# EAGLE schematic Daughter Card v5 (EAGLE 7.7.0)
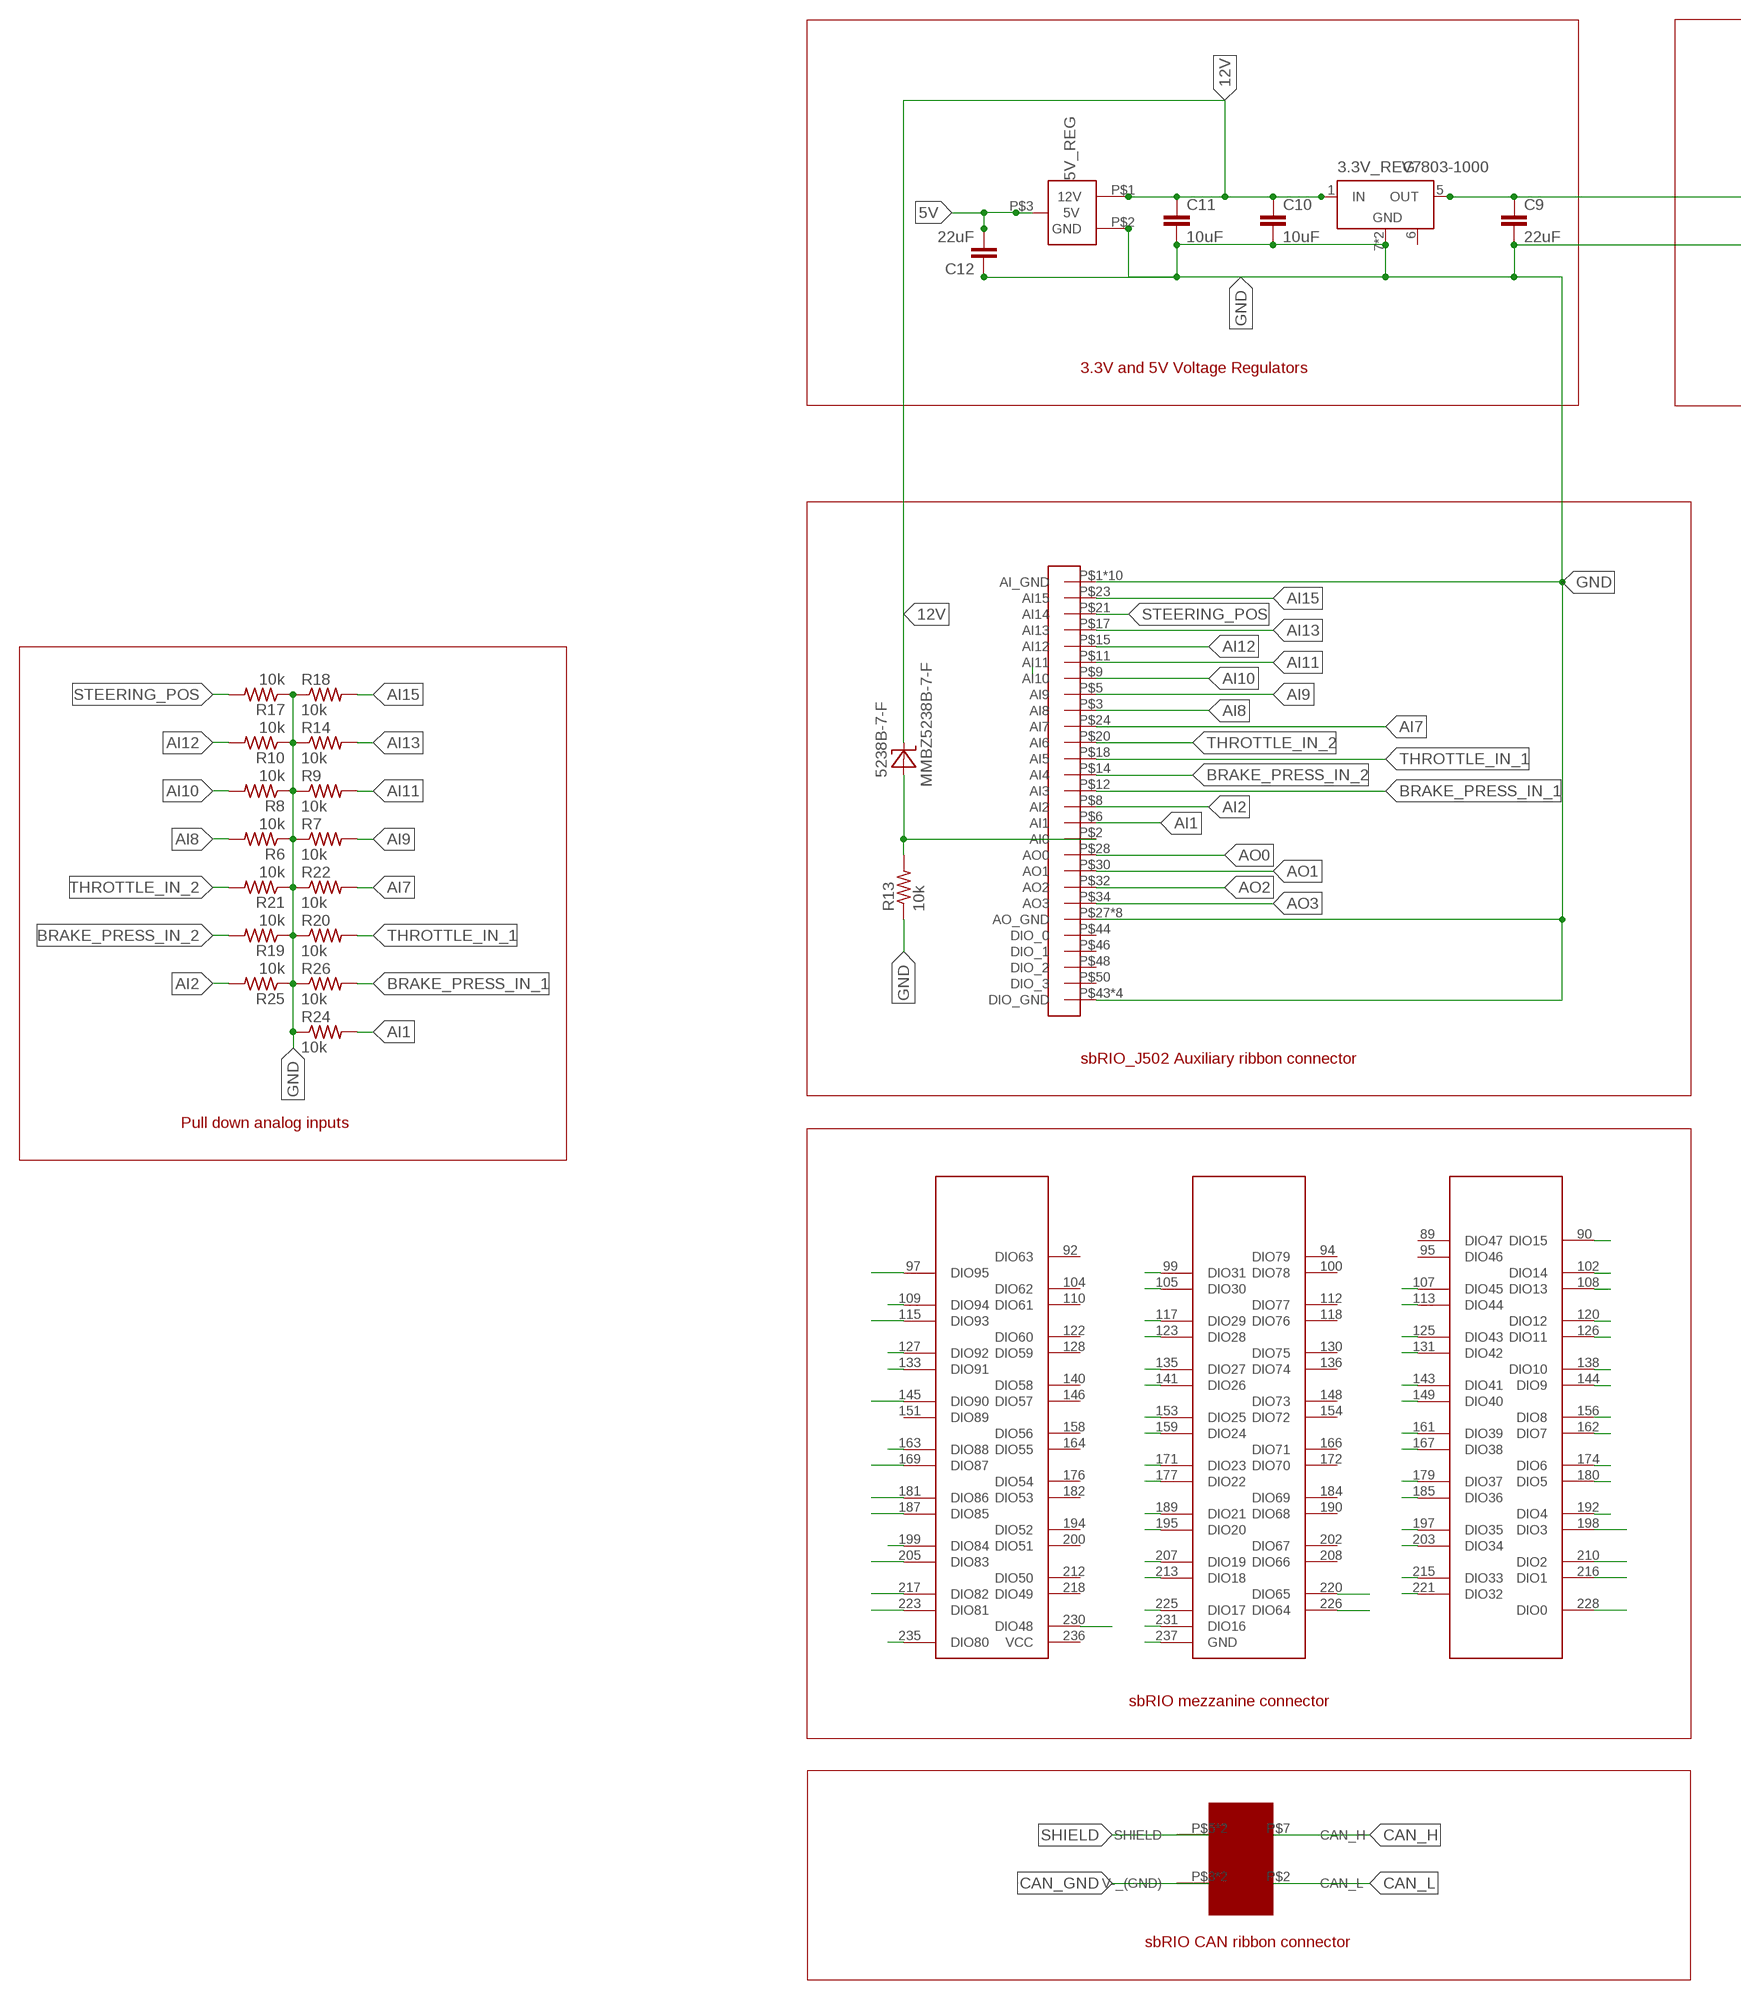
[diagram p0: schematic, sheet 1, part 1 of 2]
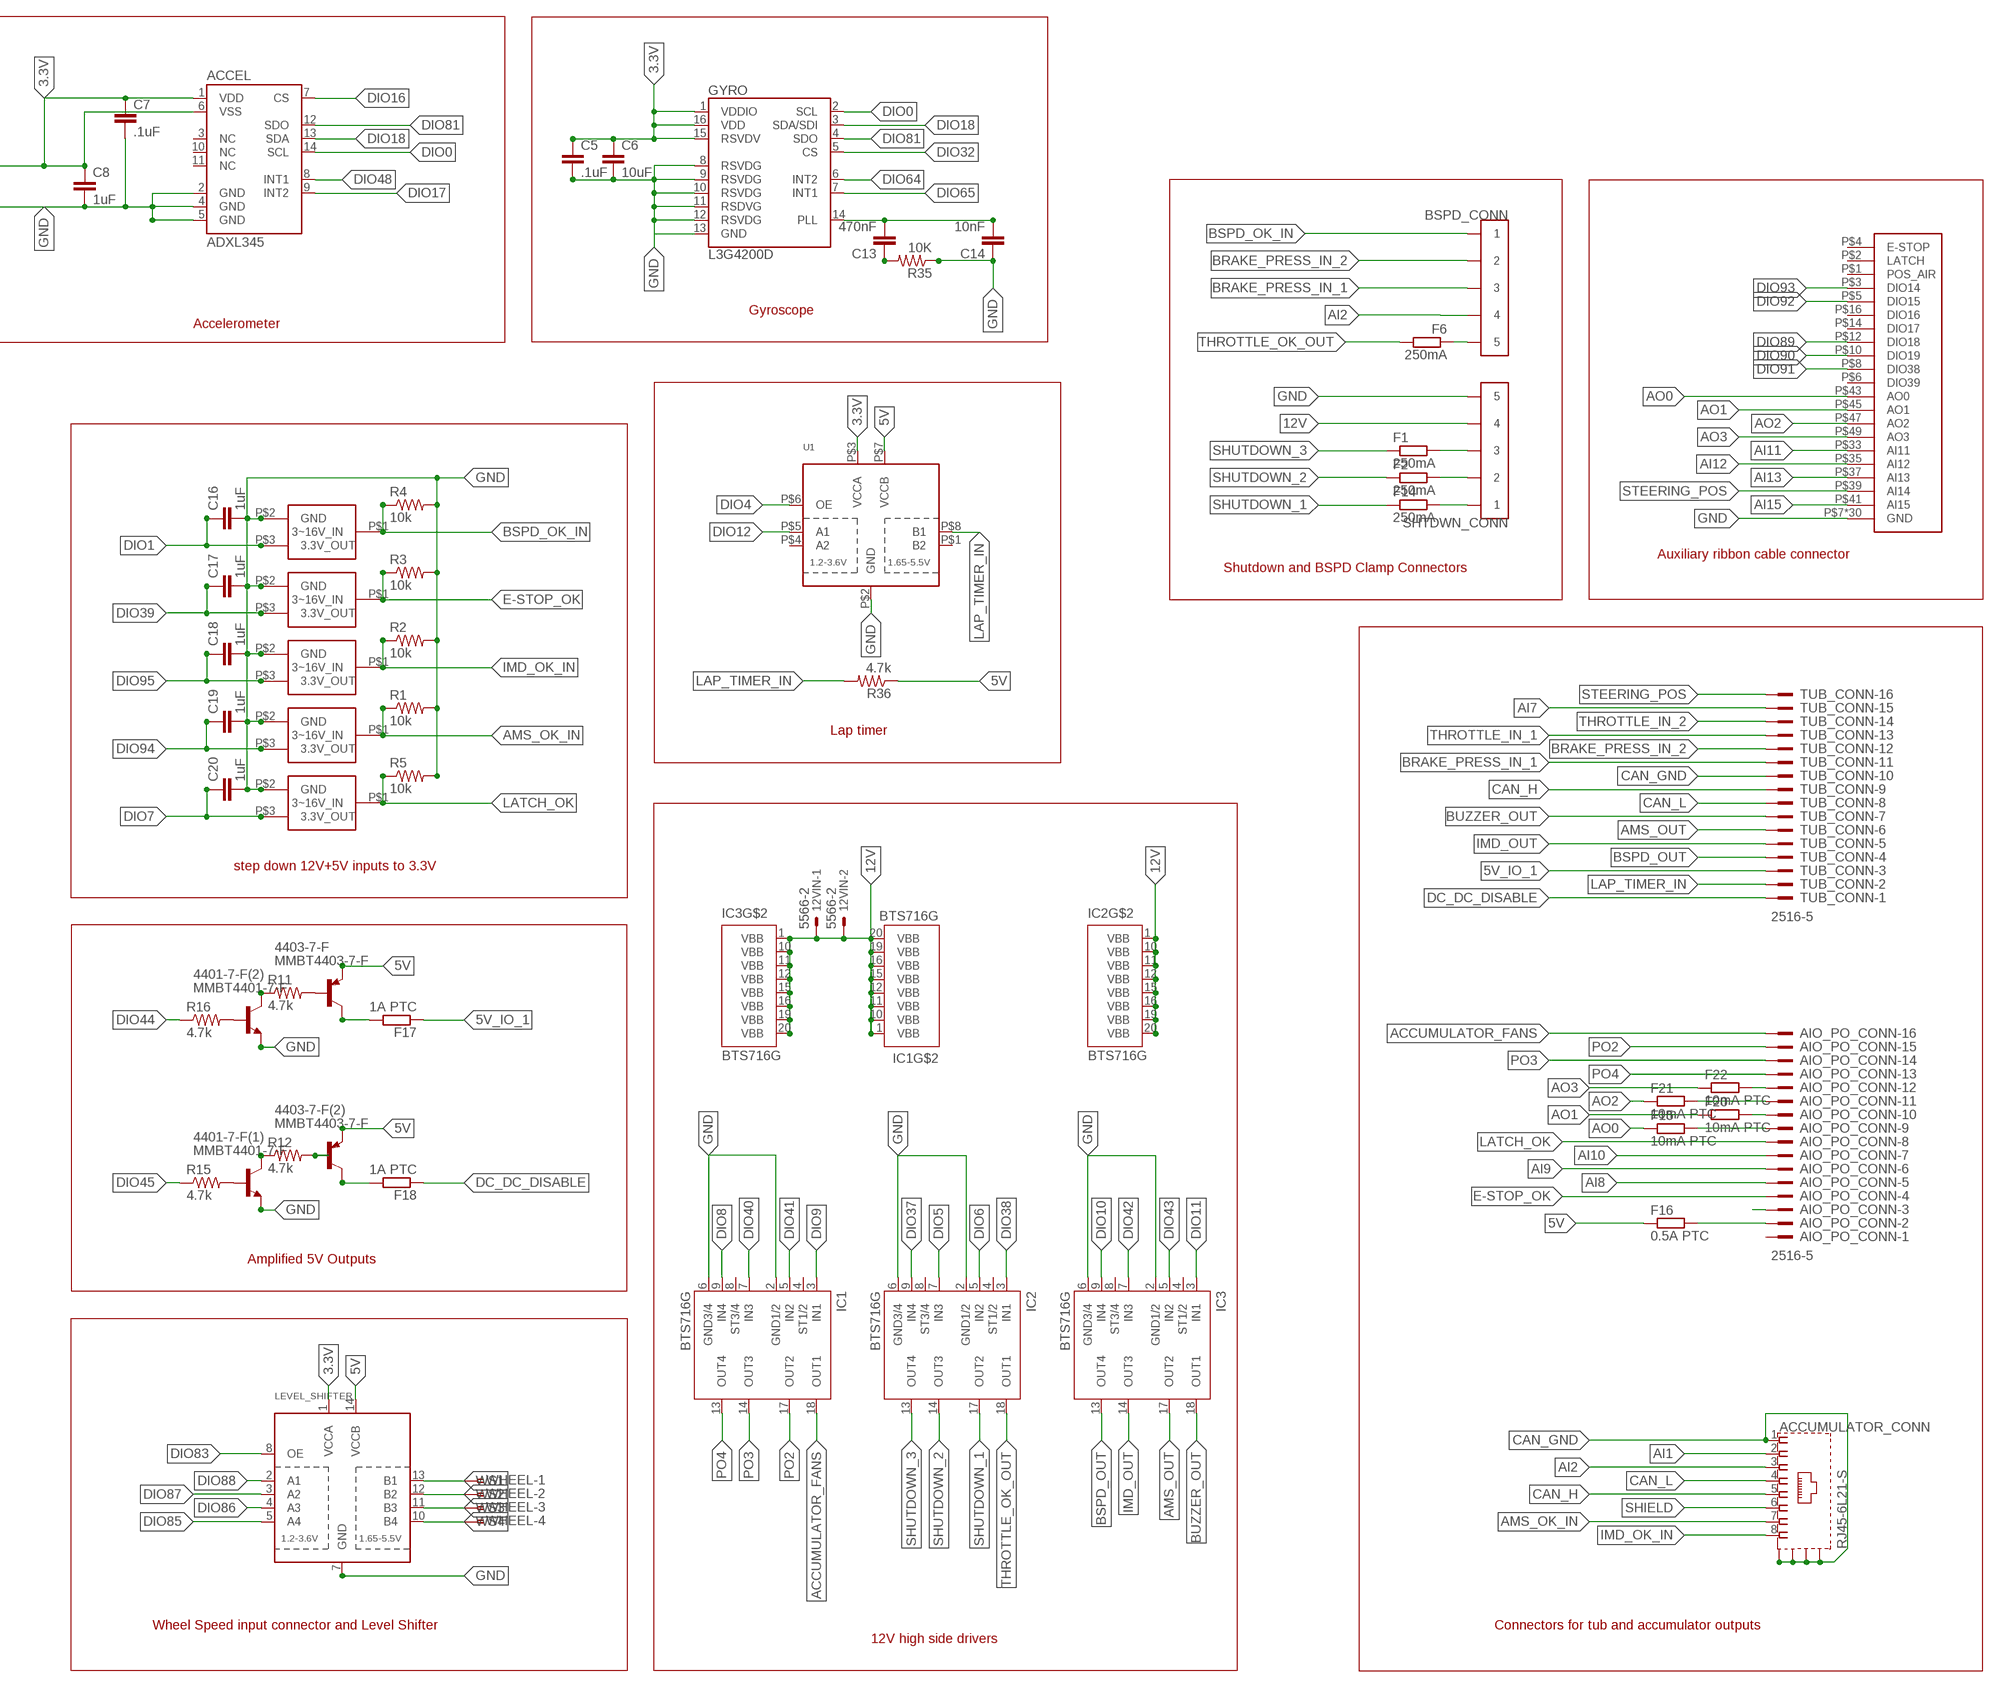
[diagram p1: schematic, sheet 1, part 2 of 2]

## Parts
3.3V_REG  V7803-1000  [V78XX-1000]
5V_REG  V78XX-1500  [V78XX-1500R]
12VIN  5566-2  [5566-2]
4401-7-F(1)  MMBT4401-7-F  [SOT-23-3]
4401-7-F(2)  MMBT4401-7-F  [SOT-23-3]
4403-7-F  MMBT4403-7-F  [SOT-23-3]
4403-7-F(2)  MMBT4403-7-F  [SOT-23-3]
5225-3.3M5-TR(5)  MIC5225-3.3YM5-TR  [SOT-23-3]
5238B-7-F  MMBZ5238B-7-F  [SOT-23-3]
5525-3.3YM5-TR(1)  MIC5225-3.3YM5-TR  [SOT-23-3]
5525-3.3YM5-TR(2)  MIC5225-3.3YM5-TR  [SOT-23-3]
5525-3.3YM5-TR(3)  MIC5225-3.3YM5-TR  [SOT-23-3]
5525-3.3YM5-TR(4)  MIC5225-3.3YM5-TR  [SOT-23-3]
ACCEL  ADXL345  [LGA14]
ACCUMULATOR_CONN  RJ45-6L21-S  [RJ45-SHIELD1]
AIO_PO_CONN  2516-5  [PAK100/2500-5-16]
BSPD_CONN  CONN_5  [CONNECTOR_5]
C5  .1uF  CAP0603-CAP  [0603-CAP]
C6  10uF  CAP0603-CAP  [0603-CAP]
C7  .1uF  CAP0603-CAP  [0603-CAP]
C8  1uF  CAP0603-CAP  [0603-CAP]
C9  22uF  CAP0603-CAP  [0603-CAP]
C10  10uF  CAP0603-CAP  [0603-CAP]
C11  10uF  CAP0603-CAP  [0603-CAP]
C12  22uF  CAP0603-CAP  [0603-CAP]
C13  470nF  CAP0603-CAP  [0603-CAP]
C14  10nF  CAP0603-CAP  [0603-CAP]
C16  1uF  CAP0603-CAP  [0603-CAP]
C17  1uF  CAP0603-CAP  [0603-CAP]
C18  1uF  CAP0603-CAP  [0603-CAP]
C19  1uF  CAP0603-CAP  [0603-CAP]
C20  1uF  CAP0603-CAP  [0603-CAP]
F1  250mA  R-EU_R0603  [R0603]
F2  250mA  R-EU_R0603  [R0603]
F6  250mA  R-EU_R0603  [R0603]
F14  250mA  R-EU_R0603  [R0603]
F15  10mA PTC  R-EU_R0402  [R0402]
F16  0.5A PTC  R-EU_R0603  [R0603]
F17  1A PTC  R-EU_R0603  [R0603]
F18  1A PTC  R-EU_R0603  [R0603]
F20  10mA PTC  R-EU_R0402  [R0402]
F21  10mA PTC  R-EU_R0402  [R0402]
F22  10mA PTC  R-EU_R0402  [R0402]
GYRO  L3G4200D  [LGA16-4X4]
IC1  BTS716G  [PG-DSO-20]
IC2  BTS716G  [PG-DSO-20]
IC3  BTS716G  [PG-DSO-20]
LEVEL_SHIFTER  TXB0104PWR  [TSSOP14]
R1  10k  R-US_R0402  [R0402]
R2  10k  R-US_R0402  [R0402]
R3  10k  R-US_R0402  [R0402]
R4  10k  R-US_R0402  [R0402]
R5  10k  R-US_R0402  [R0402]
R6  10k  R-US_R0402  [R0402]
R7  10k  R-US_R0402  [R0402]
R8  10k  R-US_R0402  [R0402]
R9  10k  R-US_R0402  [R0402]
R10  10k  R-US_R0402  [R0402]
R11  4.7k  R-US_R0402  [R0402]
R12  4.7k  R-US_R0402  [R0402]
R13  10k  R-US_R0402  [R0402]
R14  10k  R-US_R0402  [R0402]
R15  4.7k  R-US_R0402  [R0402]
R16  4.7k  R-US_R0402  [R0402]
R17  10k  R-US_R0402  [R0402]
R18  10k  R-US_R0402  [R0402]
R19  10k  R-US_R0402  [R0402]
R20  10k  R-US_R0402  [R0402]
R21  10k  R-US_R0402  [R0402]
R22  10k  R-US_R0402  [R0402]
R24  10k  R-US_R0402  [R0402]
R25  10k  R-US_R0402  [R0402]
R26  10k  R-US_R0402  [R0402]
R35  10K  RESISTOR0603-RES  [0603-RES]
R36  4.7k  R-US_R0402  [R0402]
SBRIO_ANALOG  SBRIO_MIO  [SBRIO_J502_J503]
SBRIO_AUX  SBRIO_AUX  [SBRIO_J502_J503]
SBRIO_CAN  SBRIO_W500  [SBRIO_W]
SBRIO_MEZZANINE  SBRIO_RMC  [SEAM-40-XX.X-XX-06-X-A]
SHTDWN_CONN  CONN_5  [CONNECTOR_5]
TUB_CONN  2516-5  [PAK100/2500-5-16]
U1  TXS0102  [VFSOP-8]
WHEEL  FTOP-4  [FTOP-4]

## Nets
3.3V: 3.3V_REG.5(OUT) ACCEL.1(VDD) ACCEL.6(VSS) C5.1 C6.1 C7.1 C8.1 C9.1 GYRO.1(VDDIO) GYRO.15(RSVDV) GYRO.16(VDD) LEVEL_SHIFTER.1(VCCA) U1.P$3(VCCA)
5V: 5V_REG.P$3(5V) 4403-7-F(2).P$3(E) 4403-7-F.P$3(E) C12.2 F16.1 LEVEL_SHIFTER.14(VCCB) R36.1 U1.P$7(VCCB)
5V_FUSED: AIO_PO_CONN.2 F16.2
5V_IO_1: F17.1 TUB_CONN.3
12V: 3.3V_REG.1(IN) 5V_REG.P$1(12V) 12VIN.1 12VIN.2 5238B-7-F.P$1(C) C10.1 C11.1 IC1.1(VBB) IC1.10(VBB) IC1.11(VBB) IC1.12(VBB) IC1.15(VBB) IC1.16(VBB) IC1.19(VBB) IC1.20(VBB) IC2.1(VBB) IC2.10(VBB) IC2.11(VBB) IC2.12(VBB) IC2.15(VBB) IC2.16(VBB) IC2.19(VBB) IC2.20(VBB) IC3.1(VBB) IC3.10(VBB) IC3.11(VBB) IC3.12(VBB) IC3.15(VBB) IC3.16(VBB) IC3.19(VBB) IC3.20(VBB) SHTDWN_CONN.7 SHTDWN_CONN.8
ACCUMULATOR_FANS: AIO_PO_CONN.16 IC1.18(OUT1)
AI1: ACCUMULATOR_CONN.2 R24.2 SBRIO_ANALOG.P$6(AI1)
AI2: ACCUMULATOR_CONN.3 BSPD_CONN.7 BSPD_CONN.8 R25.2 SBRIO_ANALOG.P$8(AI2)
AI7: R22.2 SBRIO_ANALOG.P$24(AI7) TUB_CONN.15
AI8: AIO_PO_CONN.5 R6.2 SBRIO_ANALOG.P$3(AI8)
AI9: AIO_PO_CONN.6 R7.2 SBRIO_ANALOG.P$5(AI9)
AI10: AIO_PO_CONN.7 R8.2 SBRIO_ANALOG.P$9(AI10)
AI11: R9.2 SBRIO_ANALOG.P$11(AI11) SBRIO_AUX.P$33(AI11)
AI12: R10.2 SBRIO_ANALOG.P$15(AI12) SBRIO_AUX.P$35(AI12)
AI13: R14.2 SBRIO_ANALOG.P$17(AI13) SBRIO_AUX.P$37(AI13)
AI15: R18.2 SBRIO_ANALOG.P$23(AI15) SBRIO_AUX.P$41(AI15)
AMS_OK_IN: 5525-3.3YM5-TR(1).P$1(3~16V_IN) ACCUMULATOR_CONN.7 R1.1
AMS_OUT: IC3.17(OUT2) TUB_CONN.6
AO0: F15.1 SBRIO_ANALOG.P$28(AO0) SBRIO_AUX.P$43(AO0)
AO1: F20.1 SBRIO_ANALOG.P$30(AO1) SBRIO_AUX.P$45(AO1)
AO2: F21.1 SBRIO_ANALOG.P$32(AO2) SBRIO_AUX.P$47(AO2)
AO3: F22.1 SBRIO_ANALOG.P$34(AO3) SBRIO_AUX.P$49(AO3)
BRAKE_PRESS_IN_1: BSPD_CONN.5 BSPD_CONN.6 R26.2 SBRIO_ANALOG.P$12(AI3) TUB_CONN.11
BRAKE_PRESS_IN_2: BSPD_CONN.3 BSPD_CONN.4 R19.2 SBRIO_ANALOG.P$14(AI4) TUB_CONN.12
BSPD_OK_IN: 5525-3.3YM5-TR(3).P$1(3~16V_IN) BSPD_CONN.1 BSPD_CONN.2 R4.1
BSPD_OUT: IC3.13(OUT4) TUB_CONN.4
BUZZER_OUT: IC3.18(OUT1) TUB_CONN.7
CAN_GND: ACCUMULATOR_CONN.1 ACCUMULATOR_CONN.S1(S) ACCUMULATOR_CONN.S2(S) ACCUMULATOR_CONN.S3(S) ACCUMULATOR_CONN.S4(S) SBRIO_CAN.P$3(V-_(GND)) SBRIO_CAN.P$6(V-_(GND)) TUB_CONN.10
CAN_H: ACCUMULATOR_CONN.5 SBRIO_CAN.P$7(CAN_H) TUB_CONN.9
CAN_L: ACCUMULATOR_CONN.4 SBRIO_CAN.P$2(CAN_L) TUB_CONN.8
DC_DC_DISABLE: F18.1 TUB_CONN.1
DIO0: ACCEL.14(SCL) GYRO.2(SCL) SBRIO_MEZZANINE.228(DIO0)
DIO1: 5525-3.3YM5-TR(3).P$3(3.3V_OUT) C16.1 SBRIO_MEZZANINE.216(DIO1)
DIO2: SBRIO_MEZZANINE.210(DIO2)
DIO3: SBRIO_MEZZANINE.198(DIO3)
DIO4: SBRIO_MEZZANINE.192(DIO4) U1.P$6(OE)
DIO5: IC2.7(IN3) SBRIO_MEZZANINE.180(DIO5)
DIO6: IC2.5(IN2) SBRIO_MEZZANINE.174(DIO6)
DIO7: 5525-3.3YM5-TR(2).P$3(3.3V_OUT) C20.1 SBRIO_MEZZANINE.162(DIO7)
DIO8: IC1.9(IN4) SBRIO_MEZZANINE.156(DIO8)
DIO9: IC1.3(IN1) SBRIO_MEZZANINE.144(DIO9)
DIO10: IC3.9(IN4) SBRIO_MEZZANINE.138(DIO10)
DIO11: IC3.3(IN1) SBRIO_MEZZANINE.126(DIO11)
DIO12: SBRIO_MEZZANINE.120(DIO12) U1.P$5(A1)
DIO13: SBRIO_MEZZANINE.108(DIO13)
DIO14: SBRIO_MEZZANINE.102(DIO14)
DIO15: SBRIO_MEZZANINE.90(DIO15)
DIO16: ACCEL.7(CS) SBRIO_MEZZANINE.231(DIO16)
DIO17: ACCEL.9(INT2) SBRIO_MEZZANINE.225(DIO17)
DIO18: ACCEL.13(SDA) GYRO.3(SDA/SDI) SBRIO_MEZZANINE.213(DIO18)
DIO19: SBRIO_MEZZANINE.207(DIO19)
DIO20: SBRIO_MEZZANINE.195(DIO20)
DIO21: SBRIO_MEZZANINE.189(DIO21)
DIO22: SBRIO_MEZZANINE.177(DIO22)
DIO23: SBRIO_MEZZANINE.171(DIO23)
DIO24: SBRIO_MEZZANINE.159(DIO24)
DIO25: SBRIO_MEZZANINE.153(DIO25)
DIO26: SBRIO_MEZZANINE.141(DIO26)
DIO27: SBRIO_MEZZANINE.135(DIO27)
DIO28: SBRIO_MEZZANINE.123(DIO28)
DIO29: SBRIO_MEZZANINE.117(DIO29)
DIO30: SBRIO_MEZZANINE.105(DIO30)
DIO31: SBRIO_MEZZANINE.99(DIO31)
DIO32: GYRO.5(CS) SBRIO_MEZZANINE.221(DIO32)
DIO33: SBRIO_MEZZANINE.215(DIO33)
DIO34: SBRIO_MEZZANINE.203(DIO34)
DIO35: SBRIO_MEZZANINE.197(DIO35)
DIO36: SBRIO_MEZZANINE.185(DIO36)
DIO37: IC2.9(IN4) SBRIO_MEZZANINE.179(DIO37)
DIO38: IC2.3(IN1) SBRIO_MEZZANINE.167(DIO38)
DIO39: 5525-3.3YM5-TR(4).P$3(3.3V_OUT) C17.1 SBRIO_MEZZANINE.161(DIO39)
DIO40: IC1.7(IN3) SBRIO_MEZZANINE.149(DIO40)
DIO41: IC1.5(IN2) SBRIO_MEZZANINE.143(DIO41)
DIO42: IC3.7(IN3) SBRIO_MEZZANINE.131(DIO42)
DIO43: IC3.5(IN2) SBRIO_MEZZANINE.125(DIO43)
DIO44: R16.1 SBRIO_MEZZANINE.113(DIO44)
DIO45: R15.1 SBRIO_MEZZANINE.107(DIO45)
DIO48: ACCEL.8(INT1) SBRIO_MEZZANINE.230(DIO48)
DIO64: GYRO.6(INT2) SBRIO_MEZZANINE.226(DIO64)
DIO65: GYRO.7(INT1) SBRIO_MEZZANINE.220(DIO65)
DIO80: SBRIO_MEZZANINE.235(DIO80)
DIO81: ACCEL.12(SDO) GYRO.4(SDO) SBRIO_MEZZANINE.223(DIO81)
DIO82: SBRIO_MEZZANINE.217(DIO82)
DIO83: LEVEL_SHIFTER.8(OE) SBRIO_MEZZANINE.205(DIO83)
DIO84: SBRIO_MEZZANINE.199(DIO84)
DIO85: LEVEL_SHIFTER.5(A4) SBRIO_MEZZANINE.187(DIO85)
DIO86: LEVEL_SHIFTER.4(A3) SBRIO_MEZZANINE.181(DIO86)
DIO87: LEVEL_SHIFTER.3(A2) SBRIO_MEZZANINE.169(DIO87)
DIO88: LEVEL_SHIFTER.2(A1) SBRIO_MEZZANINE.163(DIO88)
DIO89: SBRIO_AUX.P$12(DIO18)
DIO90: SBRIO_AUX.P$10(DIO19) SBRIO_MEZZANINE.145(DIO90)
DIO91: SBRIO_AUX.P$8(DIO38) SBRIO_MEZZANINE.133(DIO91)
DIO92: SBRIO_AUX.P$5(DIO15) SBRIO_MEZZANINE.127(DIO92)
DIO93: SBRIO_AUX.P$3(DIO14) SBRIO_MEZZANINE.115(DIO93)
DIO94: 5525-3.3YM5-TR(1).P$3(3.3V_OUT) C19.1 SBRIO_MEZZANINE.109(DIO94)
DIO95: 5225-3.3M5-TR(5).P$3(3.3V_OUT) C18.1 SBRIO_MEZZANINE.97(DIO95)
E-STOP_OK: 5525-3.3YM5-TR(4).P$1(3~16V_IN) AIO_PO_CONN.4 R3.1
GND: 3.3V_REG.7(GND) 3.3V_REG.9(GND) 5V_REG.P$2(GND) 4401-7-F(1).P$3(E) 4401-7-F(2).P$3(E) 5225-3.3M5-TR(5).P$2(GND) 5525-3.3YM5-TR(1).P$2(GND) 5525-3.3YM5-TR(2).P$2(GND) 5525-3.3YM5-TR(3).P$2(GND) 5525-3.3YM5-TR(4).P$2(GND) ACCEL.2(GND) ACCEL.4(GND) ACCEL.5(GND) C5.2 C6.2 C7.2 C8.2 C9.2 C10.2 C11.2 C12.1 C14.1 C16.2 C17.2 C18.2 C19.2 C20.2 GYRO.8(RSVDG) GYRO.9(RSVDG) GYRO.10(RSVDG) GYRO.11(RSDVG) GYRO.12(RSVDG) GYRO.13(GND) IC1.2(GND1/2) IC1.6(GND3/4) IC2.2(GND1/2) IC2.6(GND3/4) IC3.2(GND1/2) IC3.6(GND3/4) LEVEL_SHIFTER.7(GND) R1.2 R2.2 R3.2 R4.2 R5.2 R6.1 R7.1 R8.1 R9.1 R10.1 R13.1 R14.1 R17.1 R18.1 R19.1 R20.1 R21.1 R22.1 R24.1 R25.1 R26.1 R35.1 SBRIO_ANALOG.P$1(AI_GND) SBRIO_ANALOG.P$4(AI_GND) SBRIO_ANALOG.P$7(AI_GND) SBRIO_ANALOG.P$10(AI_GND) SBRIO_ANALOG.P$13(AI_GND) SBRIO_ANALOG.P$16(AI_GND) SBRIO_ANALOG.P$19(AI_GND) SBRIO_ANALOG.P$22(AI_GND) SBRIO_ANALOG.P$25(AI_GND) SBRIO_ANALOG.P$26(AI_GND) SBRIO_ANALOG.P$27(AO_GND) SBRIO_ANALOG.P$29(AO_GND) SBRIO_ANALOG.P$31(AO_GND) SBRIO_ANALOG.P$33(AO_GND) SBRIO_ANALOG.P$35(AO_GND) SBRIO_ANALOG.P$37(AO_GND) SBRIO_ANALOG.P$39(AO_GND) SBRIO_ANALOG.P$41(AO_GND) SBRIO_ANALOG.P$43(DIO_GND) SBRIO_ANALOG.P$45(DIO_GND) SBRIO_ANALOG.P$47(DIO_GND) SBRIO_ANALOG.P$49(DIO_GND) SBRIO_AUX.P$7(GND) SBRIO_AUX.P$9(GND) SBRIO_AUX.P$11(GND) SBRIO_AUX.P$13(GND) SBRIO_AUX.P$15(GND) SBRIO_AUX.P$17(GND) SBRIO_AUX.P$18(GND) SBRIO_AUX.P$19(GND) SBRIO_AUX.P$20(GND) SBRIO_AUX.P$21(GND) SBRIO_AUX.P$22(GND) SBRIO_AUX.P$23(GND) SBRIO_AUX.P$24(GND) SBRIO_AUX.P$25(GND) SBRIO_AUX.P$26(GND) SBRIO_AUX.P$27(GND) SBRIO_AUX.P$28(GND) SBRIO_AUX.P$29(GND) SBRIO_AUX.P$30(GND) SBRIO_AUX.P$31(GND) SBRIO_AUX.P$32(GND) SBRIO_AUX.P$34(GND) SBRIO_AUX.P$36(GND) SBRIO_AUX.P$38(GND) SBRIO_AUX.P$40(GND) SBRIO_AUX.P$42(GND) SBRIO_AUX.P$44(GND) SBRIO_AUX.P$46(GND) SBRIO_AUX.P$48(GND) SBRIO_AUX.P$50(GND) SBRIO_MEZZANINE.237(GND) SHTDWN_CONN.9 SHTDWN_CONN.10 U1.P$2(GND)
IMD_OK_IN: 5225-3.3M5-TR(5).P$1(3~16V_IN) ACCUMULATOR_CONN.8 R2.1
IMD_OUT: IC3.14(OUT3) TUB_CONN.5
LAP_TIMER_IN: R36.2 TUB_CONN.2 U1.P$8(B1)
LATCH_OK: 5525-3.3YM5-TR(2).P$1(3~16V_IN) AIO_PO_CONN.8 R5.1
N$3: AIO_PO_CONN.9 F15.2
N$4: 5238B-7-F.P$2(A) R13.2 SBRIO_ANALOG.P$2(AI0)
N$6: AIO_PO_CONN.10 F20.2
N$9: AIO_PO_CONN.11 F21.2
N$10: AIO_PO_CONN.12 F22.2
N$11: F1.2 SHTDWN_CONN.5 SHTDWN_CONN.6
N$29: AIO_PO_CONN.3
N$37: C13.2 C14.2 GYRO.14(PLL)
N$38: C13.1 R35.2
N$41: BSPD_CONN.9 BSPD_CONN.10 F6.1
N$54: 4403-7-F.P$2(B) R11.2
N$56: 4403-7-F.P$1(C) F17.2
N$57: 4403-7-F(2).P$1(C) F18.2
N$58: 4403-7-F(2).P$2(B) R12.2
N$60: 4401-7-F(1).P$2(B) R15.2
N$61: 4401-7-F(1).P$1(C) R12.1
N$62: 4401-7-F(2).P$2(B) R16.2
N$63: 4401-7-F(2).P$1(C) R11.1
PO2: AIO_PO_CONN.15 IC1.17(OUT2)
PO3: AIO_PO_CONN.14 IC1.14(OUT3)
PO4: AIO_PO_CONN.13 IC1.13(OUT4)
SHIELD: ACCUMULATOR_CONN.6 SBRIO_CAN.P$5(SHIELD) SBRIO_CAN.P$10(SHIELD)
SHUTDOWN_1: F14.1 IC2.17(OUT2)
SHUTDOWN_1_FUSED: F14.2 SHTDWN_CONN.1 SHTDWN_CONN.2
SHUTDOWN_2: F2.1 IC2.14(OUT3)
SHUTDOWN_2_FUSED: F2.2 SHTDWN_CONN.3 SHTDWN_CONN.4
SHUTDOWN_3: F1.1 IC2.13(OUT4)
STEERING_POS: R17.2 SBRIO_ANALOG.P$21(AI14) SBRIO_AUX.P$39(AI14) TUB_CONN.16
THROTTLE_IN_1: R20.2 SBRIO_ANALOG.P$18(AI5) TUB_CONN.13
THROTTLE_IN_2: R21.2 SBRIO_ANALOG.P$20(AI6) TUB_CONN.14
THROTTLE_OK_OUT: F6.2 IC2.18(OUT1)
WS1: LEVEL_SHIFTER.13(B1) WHEEL.1
WS2: LEVEL_SHIFTER.12(B2) WHEEL.2
WS3: LEVEL_SHIFTER.11(B3) WHEEL.3
WS4: LEVEL_SHIFTER.10(B4) WHEEL.4
Unconnected: 3.3V_REG.6 ACCEL.3(NC) ACCEL.10(NC) ACCEL.11(NC) AIO_PO_CONN.1 IC1.4(ST1/2) IC1.8(ST3/4) IC2.4(ST1/2) IC2.8(ST3/4) IC3.4(ST1/2) IC3.8(ST3/4) SBRIO_ANALOG.P$44(DIO_0) SBRIO_ANALOG.P$46(DIO_1) SBRIO_ANALOG.P$48(DIO_2) SBRIO_ANALOG.P$50(DIO_3) SBRIO_AUX.P$1(POS_AIR) SBRIO_AUX.P$2(LATCH) SBRIO_AUX.P$4(E-STOP) SBRIO_AUX.P$6(DIO39) SBRIO_AUX.P$14(DIO17) SBRIO_AUX.P$16(DIO16) SBRIO_MEZZANINE.89(DIO47) SBRIO_MEZZANINE.92(DIO63) SBRIO_MEZZANINE.94(DIO79) SBRIO_MEZZANINE.95(DIO46) SBRIO_MEZZANINE.100(DIO78) SBRIO_MEZZANINE.104(DIO62) SBRIO_MEZZANINE.110(DIO61) SBRIO_MEZZANINE.112(DIO77) SBRIO_MEZZANINE.118(DIO76) SBRIO_MEZZANINE.122(DIO60) SBRIO_MEZZANINE.128(DIO59) SBRIO_MEZZANINE.130(DIO75) SBRIO_MEZZANINE.136(DIO74) SBRIO_MEZZANINE.140(DIO58) SBRIO_MEZZANINE.146(DIO57) SBRIO_MEZZANINE.148(DIO73) SBRIO_MEZZANINE.151(DIO89) SBRIO_MEZZANINE.154(DIO72) SBRIO_MEZZANINE.158(DIO56) SBRIO_MEZZANINE.164(DIO55) SBRIO_MEZZANINE.166(DIO71) SBRIO_MEZZANINE.172(DIO70) SBRIO_MEZZANINE.176(DIO54) SBRIO_MEZZANINE.182(DIO53) SBRIO_MEZZANINE.184(DIO69) SBRIO_MEZZANINE.190(DIO68) SBRIO_MEZZANINE.194(DIO52) SBRIO_MEZZANINE.200(DIO51) SBRIO_MEZZANINE.202(DIO67) SBRIO_MEZZANINE.208(DIO66) SBRIO_MEZZANINE.212(DIO50) SBRIO_MEZZANINE.218(DIO49) U1.P$1(B2) U1.P$4(A2)

## Notes on the sheet
- 3.3V and 5V Voltage Regulators | Gyroscope
- Accelerometer
- Auxiliary ribbon cable connector
- Shutdown and BSPD Clamp Connectors
- Lap timer
- step down 12V+5V inputs to 3.3V
- sbRIO_J502 Auxiliary ribbon connector
- Pull down analog inputs
- Amplified 5V Outputs
- sbRIO mezzanine connector
- Wheel Speed input connector and Level Shifter | Connectors for tub and accumulator outputs
- sbRIO CAN ribbon connector | 12V high side drivers

## Power pins joined to a net without a drawn wire
VCC: SBRIO_MEZZANINE.236(VCC)

## Library data of the parts
3.3V_REG = formula electric:V7803-1000
5V_REG = formula electric:V78XX-1500
12VIN = con-molex:5566-2: Mini FIT connector 2 pol Source: http://www.molex.com; OC_FARNELL: 1822072; OC_NEWARK: unknown
4401-7-F(1) 4401-7-F(2) = formula electric:MMBT4401-7-F
4403-7-F 4403-7-F(2) = formula electric:MMBT4403-7-F
5225-3.3M5-TR(5) 5525-3.3YM5-TR(1) 5525-3.3YM5-TR(2) 5525-3.3YM5-TR(3) 5525-3.3YM5-TR(4) = formula electric:MIC5225-3.3YM5-TR: not the device name DIGIKEY PN: MCP1703T-3302E/CBCT-ND; DIGIKEYPN: MCP1703T-3302E/CBCT-ND
5238B-7-F = formula electric:MMBZ5238B-7-F: Digikey: MMBZ5238B-FDICT-ND
ACCEL = SparkFun-Sensors:ADXL345: 3-axis SPI/I2C 2/4/8/16g accelerometer
ACCUMULATOR_CONN = con-tycoelectronics:RJ45*2: RJ45 Low Profile Shield Type 2 For all RJ45 L, LC, LCT and X Series Models Source: www.tycoelectronics.com .. ENG_DS_1654001_1099_RJ_L_0507.pdf; OC_FARNELL: unknown; OC_NEWARK: unknown
AIO_PO_CONN TUB_CONN = con-3m:2516-: 3M (TM) Pak 100 4-Wall Header Source: 3M; MPN: D2516-5002-AR; OC_FARNELL: 9838376; OC_NEWARK: 12P7055
BSPD_CONN SHTDWN_CONN = formula electric:CONN_5
C5-C14 C16-C20 = SparkFun-Passives:CAP: Capacitor Standard 0603 ceramic capacitor, and 0.1" leaded capacitor.
F1 F2 F6 F14-F18 F20-F22 = resistor:R-EU_: RESISTOR, European symbol
GYRO = SparkFun-Sensors:L3G4200D: L3G4200D Three-axis, digital output gyroscope The L3G4200D is a low-power three-axis angular rate sensor, has a full scale of ±250/±500/±2000 dps and is capable of measuring rates with a user-selectable bandwidth. It includes a sensing element and an IC interface capable of providing the measured angular rate to the external world through a digital interface (I2C/SPI). Package: 4x4x1.1 LGA-16 (LGA16-4x4.PAC)
IC1-IC3 = infineon:BTS716G: Smart High-Side Power Switch Four Channels: 4 x 140mOhm staus Feedback Source: http://www.infineon.com/dgdl/BTS716G.pdf; OC_FARNELL: unknown; OC_NEWARK: unknown
LEVEL_SHIFTER = SparkFun-DigitalIC:TXB0104PWR: 4-Bit Bi-Directional Level Shifter 1.2V-3.6V (VCCA) to 1.65V-5.5V (VCCB) bi-directional level shifter with auto direction sensing. Max data rate - VCCA 1.8V: 20Mbps (50ns), VCCA 3.3V: 100Mbps (10ns) Digikey: 296-21929-1-ND (TSSOP) IC-11329
R1-R22 R24-R26 R36 = resistor:R-US_: RESISTOR, American symbol
R35 = SparkFun-Passives:RESISTOR: Resistor Basic schematic elements and footprints for 0603, 1206, and PTH resistors.
SBRIO_ANALOG = formula electric:SBRIO_MIO
SBRIO_AUX = formula electric:SBRIO_AUX: An output for a lot of the extra pins on the sbRIO.
SBRIO_CAN = formula electric:SBRIO_W500
SBRIO_MEZZANINE = SEAM-40-XX.X-XX-06-X-A:SBRIO_RMC
U1 = adafruit:TXS0102: 2-Bit Bi-Directional Level Shifter (I2C, etc.) Designed for I2C devices and has internal pullups. Not to be confused with TXB010x series. 1.2V-3.6V (VCCA) to 1.65V-5.5V (VCCB) bi-directional level shifter with auto direction sensing. Max data rate - 24Mbps (Push Pull), 2Mbps (Open Drain) Digikey: 296-21931-1-ND
WHEEL = con-amp:FTOP-4: AMP connector

## Net classes
0 default: clearance 0.205 mm